# EAGLE design tda (EAGLE 9.6.2)
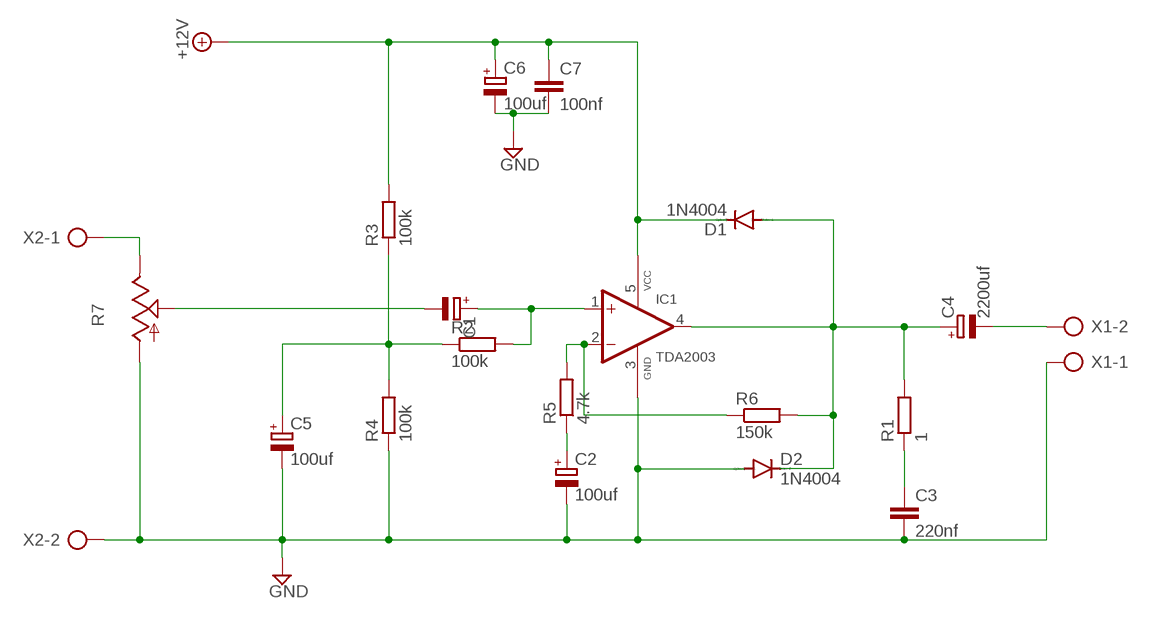
[diagram p0: schematic, sheet 1]

## Parts
C1  CPOL-EUE2-5  [E2-5]
C2  100uf  CPOL-EUE2-5  [E2-5]
C3  220nf  C-EU025-030X050  [C025-030X050]
C4  2200uf  CPOL-EUE2-5  [E2-5]
C5  100uf  CPOL-EUE2-5  [E2-5]
C6  100uf  CPOL-EUE2-5  [E2-5]
C7  100nf  C-EU025-030X050  [C025-030X050]
D1  1N4004  [DO41-10]
D2  1N4004  [DO41-10]
IC1  TDA2003  [PENTAWATT-V]
R1  1  R-EU_0309/12  [0309/12]
R2  100k  R-EU_0309/12  [0309/12]
R3  100k  R-EU_0309/12  [0309/12]
R4  100k  R-EU_0309/12  [0309/12]
R5  4.7k  R-EU_0309/12  [0309/12]
R6  150k  R-EU_0309/12  [0309/12]
R7  TRIM_US-CIP20C-6MM  [CIP20C-6MM]
X1  AK300/2  [AK300/2]
X2  AK300/2  [AK300/2]

## Nets
+12V: C6.+ C7.1 D1.C IC1.5(VCC) R3.2
GND: C2.- C3.2 C5.- C6.- C7.2 D2.A IC1.3(GND) R4.1 R7.A X1.1 X2.2
N$1: C4.- X1.2
N$2: C4.+ D1.A D2.C IC1.4(OUT) R1.2 R6.2
N$3: C3.1 R1.1
N$4: C1.- R7.S
N$5: R7.E X2.1
N$6: IC1.2(-IN) R5.2 R6.1
N$7: C2.+ R5.1
N$8: C1.+ IC1.1(+IN) R2.2
N$10: C5.+ R2.1 R3.1 R4.2

## Library data of the parts
C1 C2 C4-C6 = rcl:CPOL-EU: POLARIZED CAPACITOR, European symbol; SPICEPREFIX: C
C3 C7 = rcl:C-EU: CAPACITOR, European symbol; SPICEPREFIX: C
D1 D2 = diode:1N4004: DIODE general purpose rectifier, 1 A
IC1 = tda2003:TDA2003: Car Radio Audio Amplifier
R1-R6 = rcl:R-EU_: RESISTOR, European symbol; SPICEPREFIX: R
R7 = pot:TRIM_US-: POTENTIOMETER
X1 X2 = con-ptr500:AK300/2: CONNECTOR; OC_FARNELL: unknown; OC_NEWARK: unknown

## Board
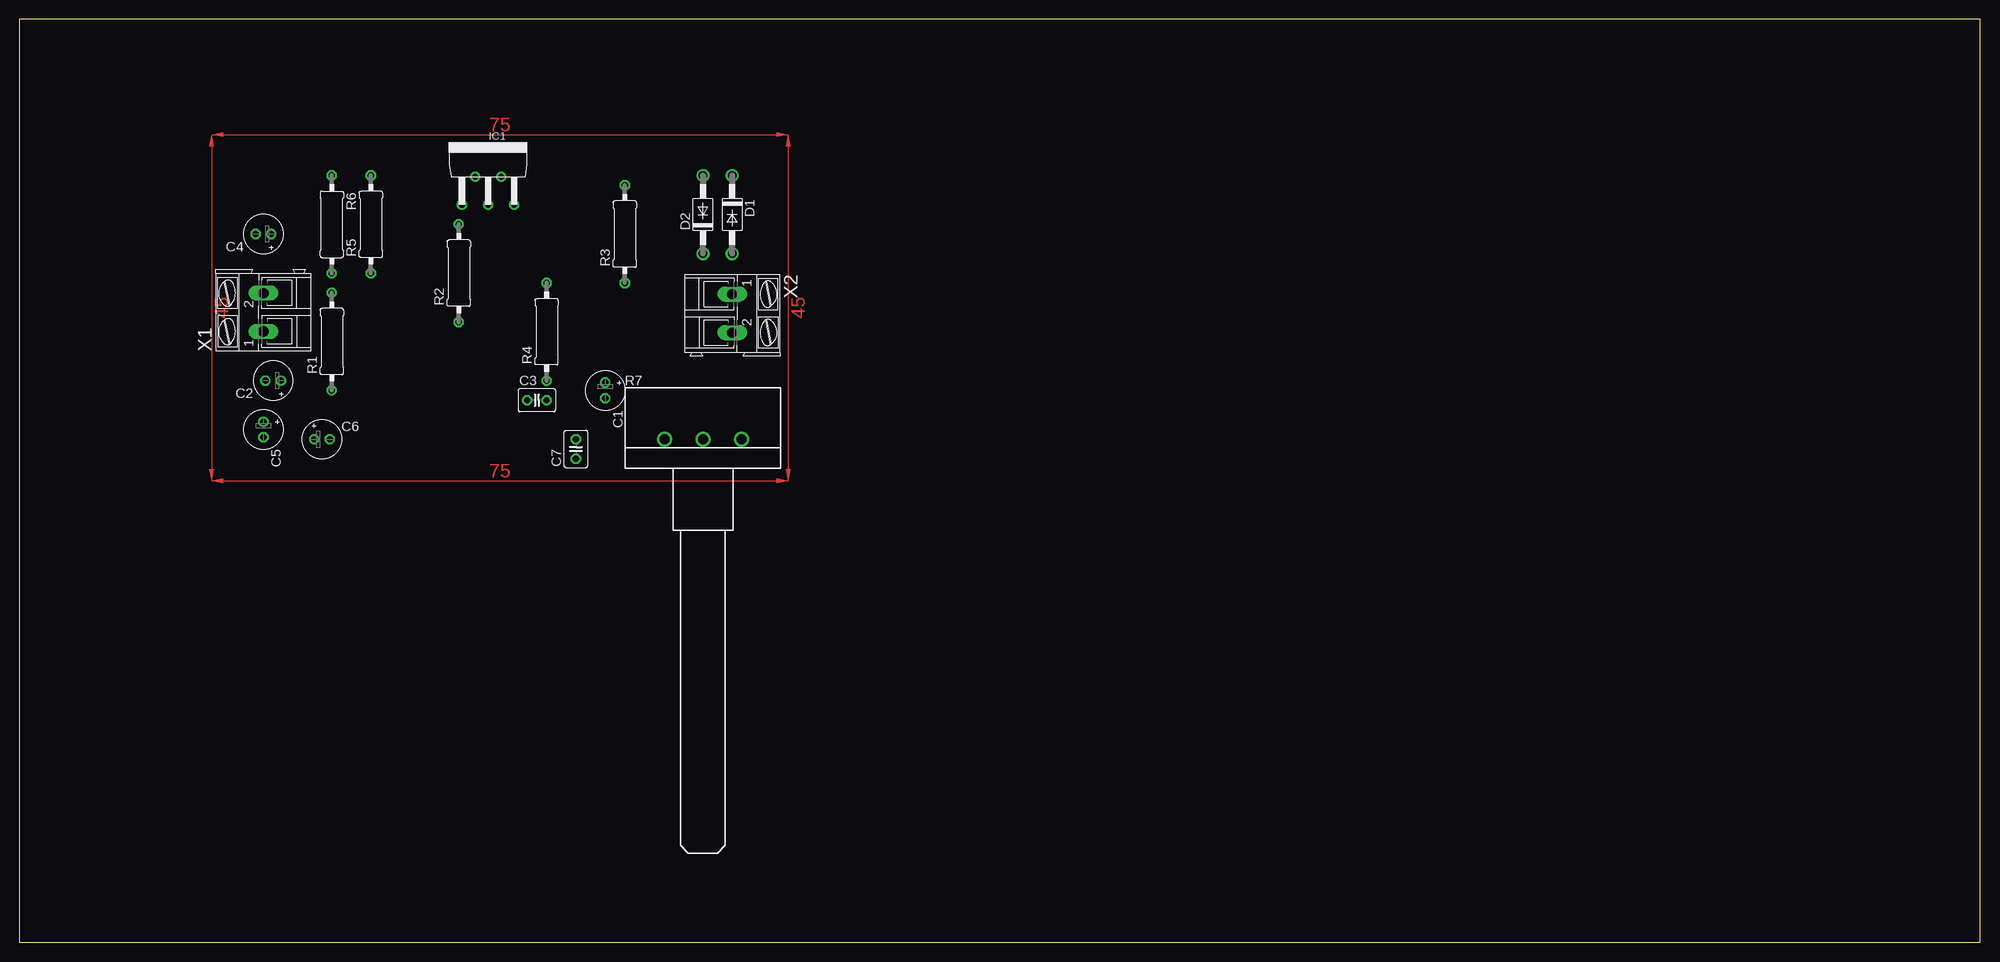
[diagram p1: board, top side]
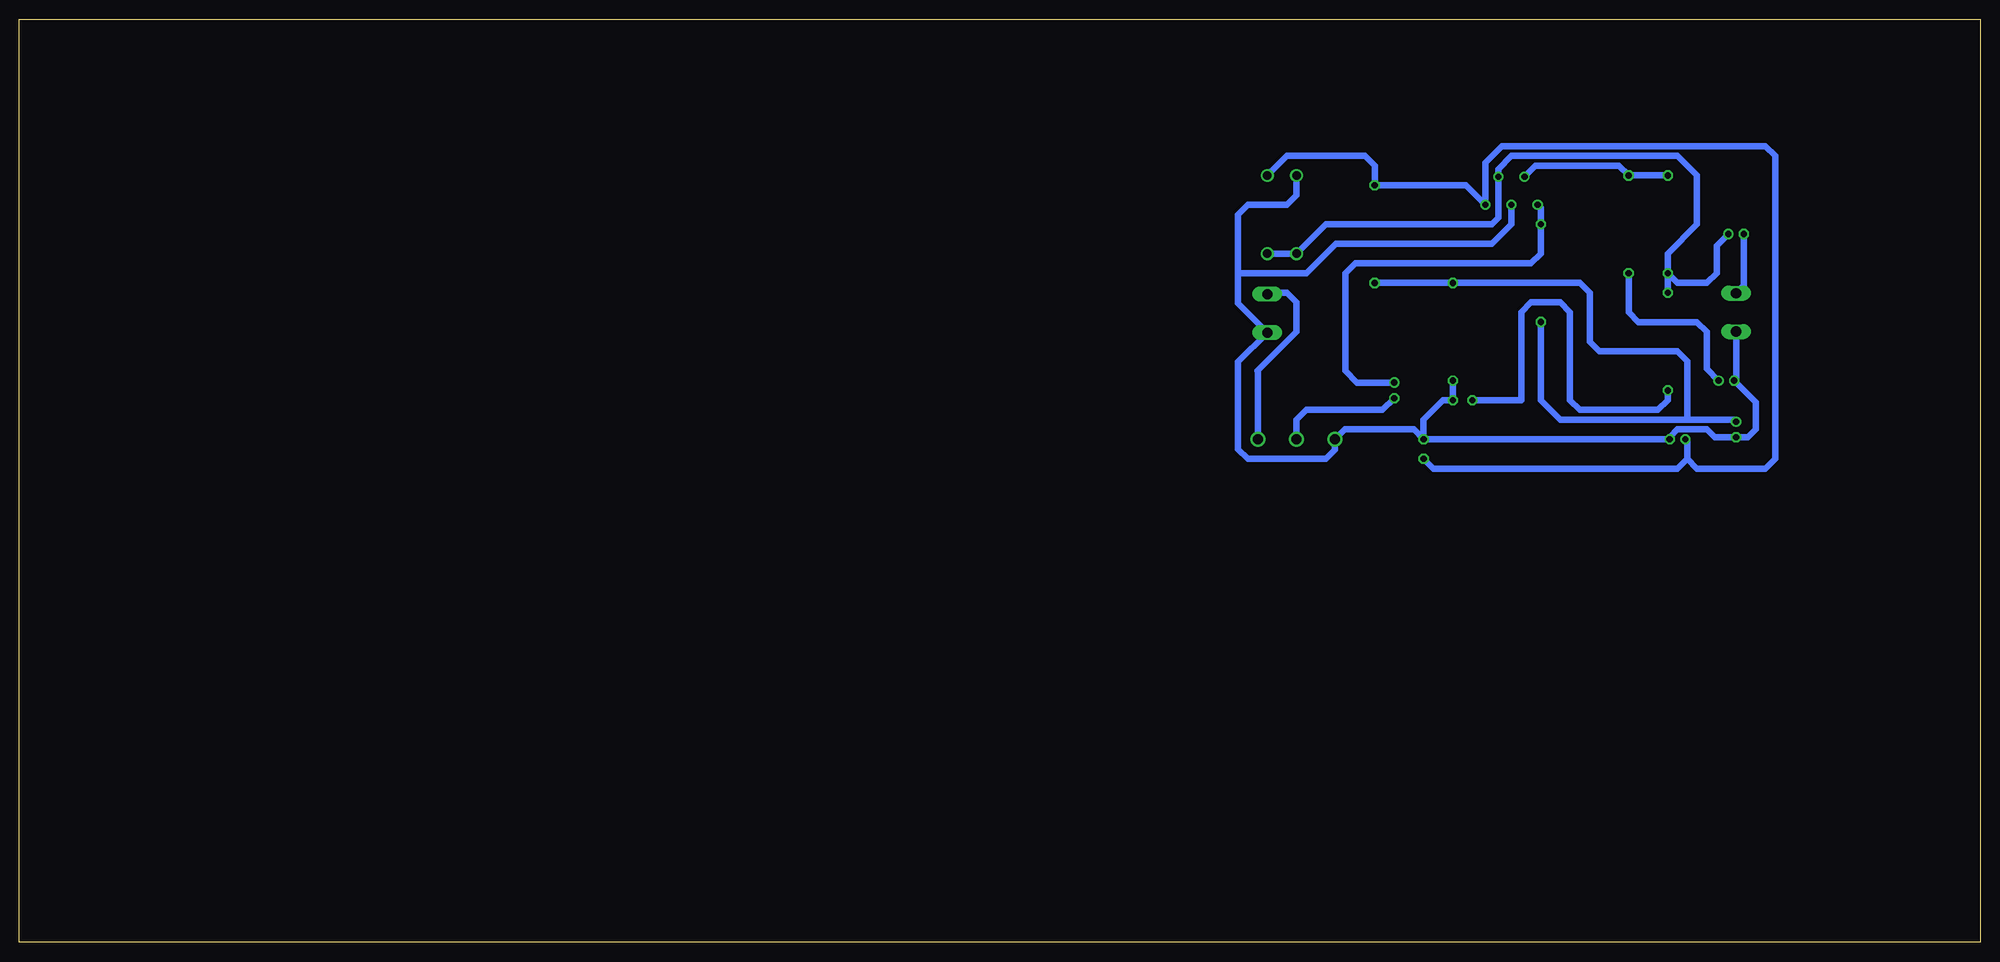
[diagram p2: board, bottom side, seen from below]

Size 255 x 120 mm. Coordinates in mm from the lower left corner, seen from the top.
Outline: 0,0 255,0 255,120 0,120 0,0
Copper layers (1*16): Top 0.035mm / dielectric 1.5mm / Bottom 0.035mm
Design rules "default": minimum track width 6mil, minimum drill 0.35mm, track to track 6mil, track to pad 6mil, pad to pad 6mil, via to via 6mil, smd to smd 6mil, copper to edge 40mil, drill to drill 6mil, minimum pad ring 10mil, minimum via ring 8mil, stop-mask expansion 4mil, vias tented up to drill 0mil, thermal gap 10mil

### Footprints (pad centres in the part's own frame; a part is rotated, then mirrored left to right if it is on the bottom)
E2-5 = drill 0.813 pad 1.27: + -1.016,0 | drill 0.813 pad 1.27 octagon: - 1.016,0
C025-030X050 = drill 0.813 octagon: 1 -1.27,0; 2 1.27,0
DO41-10 = drill 1.118: A 5.08,0; C -5.08,0
PENTAWATT-V = drill 0.8: 1 -3.4,-3.81; 2 -1.7,-0.16; 3 0,-3.81; 4 1.7,-0.16; 5 3.4,-3.81
0309/12 = drill 0.813 octagon: 1 -6.35,0; 2 6.35,0
CIP20C-6MM = drill 1.3 pad 1.93: A -5,0; E 5,0; S 0,0
AK300/2 = drill 1.321 long: 1 -2.515,0; 2 2.489,0

### Placement (x,y rotation side)
C1  76.2,71.75 270 top
C2  33.02,73.02 180 top
C3  67.31,70.48 0 top
C4  31.75,92.07 180 top
C5  31.75,66.67 270 top
C6  39.37,65.4 0 top
C7  72.39,64.13 90 top
D1  92.71,94.61 270 top
D2  88.9,94.61 90 top
IC1  60.96,99.69 0 top
R1  40.64,78.1 90 top
R2  57.15,86.99 90 top
R3  78.74,92.07 90 top
R4  68.58,79.37 90 top
R5  45.72,93.34 90 top
R6  40.64,93.34 270 top
R7  88.9,65.4 0 top
X1  31.75,81.91 90 top
X2  92.71,81.75 270 top

### Tracks (layer width: path | path; a pad name or v marks a point on that pad's centre or on a via)
+12V
  Bottom 0.813: D1.C 90.17,102.23 80.01,102.23 78.74,100.96 R3.2 66.9,98.42 IC1.5 64.36,101.37 62.23,103.5 27.94,103.5 26.67,102.23 26.67,62.86 27.94,61.59 36.83,61.59 38.1,62.86 | C7.1 71.12,61.59 39.37,61.59 38.1,62.86 | 38.1,62.86 38.1,65.15 C6.+
GND
  Bottom 0.813: D2.A 88.9,97.15 90.17,95.88 95.25,95.88 96.52,94.61 96.52,86.99 | 96.52,86.99 96.52,83.07 X2.2 96.52,75.45 96.52,64.13 95.25,62.86 85.09,62.86 83.9,64.05 R7.A 82.63,66.67 73.66,66.67 C7.2 | X1.1 31.75,73.27 C2.- 29.21,70.23 29.21,66.67 30.23,65.65 C5.- 34.54,65.65 35.56,66.67 39.37,66.67 40.39,65.65 C6.- C7.2 | C7.2 72.39,67.94 69.85,70.48 C3.2 R4.1 | IC1.3 60.96,93.34 63.5,90.8 83.82,90.8 87.63,86.99 96.52,86.99
N$1
  Bottom 0.813: C4.- 30.73,85.41 X1.2
N$2
  Bottom 0.813: D1.A D2.C 85.09,93.34 63.5,93.34 62.66,94.18 IC1.4 62.66,100.53 60.96,102.23 39.37,102.23 36.83,99.69 36.83,93.34 40.64,89.53 R6.2 | C4.+ 34.29,90.55 34.29,86.99 35.56,85.72 39.37,85.72 R6.2 | R6.2 R1.2
N$3
  Bottom 0.813: C3.1 59.69,70.48 59.69,81.91 58.42,83.18 54.61,83.18 53.34,81.91 53.34,70.48 52.07,69.21 41.91,69.21 40.64,70.48 R1.1
N$4
  Bottom 0.813: C1.- 77.72,69.21 87.63,69.21 88.9,67.94 R7.S
N$5
  Bottom 0.813: R7.E 93.9,74.21 93.98,74.29 88.9,79.37 88.9,83.18 90.17,84.45 92.53,84.45 X2.1
N$6
  Bottom 0.813: IC1.2 57.83,100.96 46.99,100.96 R5.2 R6.1
N$7
  Bottom 0.813: C2.+ 35.56,74.54 35.56,79.37 36.83,80.64 44.45,80.64 45.72,81.91 R5.1
N$8
  Bottom 0.813: IC1.1 57.15,95.47 R2.2 57.15,89.53 58.42,88.26 81.28,88.26 82.55,86.99 82.55,74.29 81.03,72.77 C1.+
N$10
  Bottom 0.813: C5.+ 32,67.94 38.1,67.94 | R2.1 57.15,70.48 54.61,67.94 38.1,67.94 | R3.1 R4.2 52.07,85.72 50.8,84.45 50.8,78.1 49.53,76.83 39.37,76.83 38.1,75.56 38.1,67.94
(copper drawn outside any net)
  shapes: Top area x4